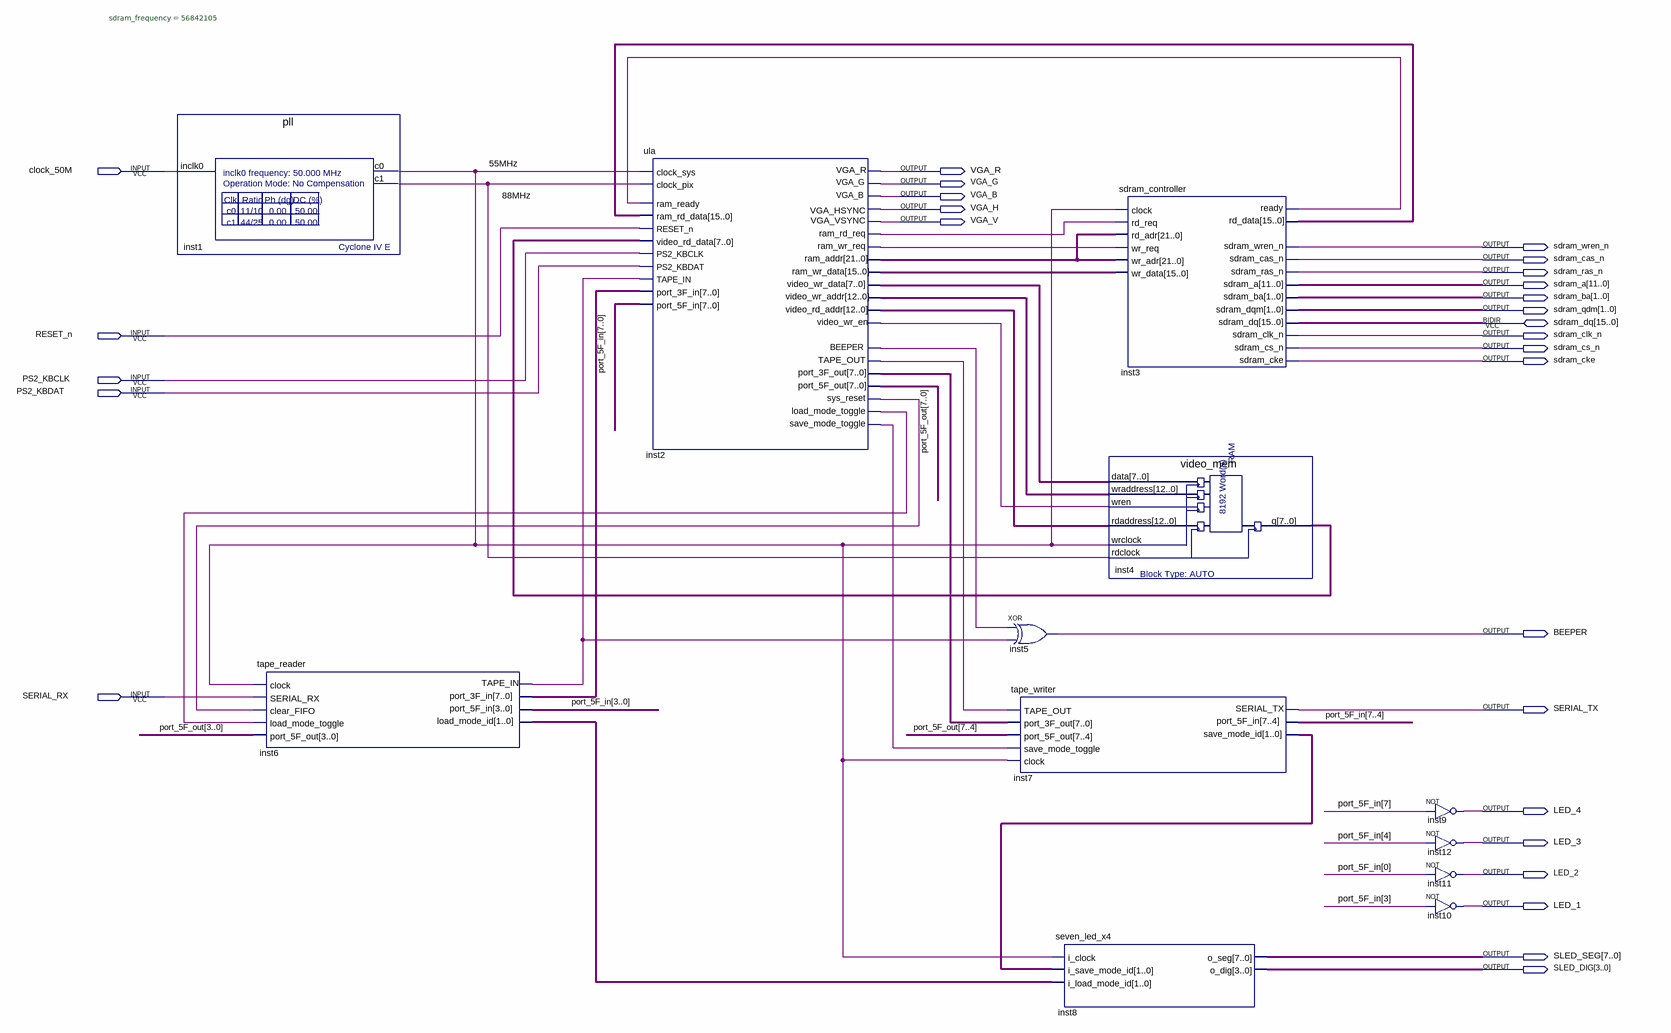
[diagram p0: schematic sheet]
// Quartus schematic zx48.bdf as structural Verilog: 12 symbols, 28 pins
module zx48 (
  input  clock_50M,
  input  RESET_n,
  input  PS2_KBCLK,
  input  PS2_KBDAT,
  input  SERIAL_RX,
  inout  [15:0] sdram_dq,
  output VGA_R,
  output VGA_G,
  output VGA_B,
  output VGA_H,
  output VGA_V,
  output sdram_wren_n,
  output sdram_cas_n,
  output sdram_ras_n,
  output [11:0] sdram_a,
  output [1:0] sdram_ba,
  output [1:0] sdram_qdm,
  output sdram_clk_n,
  output sdram_cs_n,
  output sdram_cke,
  output BEEPER,
  output SERIAL_TX,
  output LED_4,
  output LED_3,
  output LED_2,
  output LED_1,
  output [7:0] SLED_SEG,
  output [3:0] SLED_DIG
);

  wire \55MHz , \88MHz , inst2_beeper, inst2_load_mode_toggle, inst2_ram_rd_req, inst2_ram_wr_req,
       inst2_save_mode_toggle, inst2_sys_reset, inst2_tape_out, inst2_video_wr_en, inst3_ready, inst6_tape_in;
  wire [1:0] inst6_load_mode_id, inst7_save_mode_id;
  wire [7:0] inst2_port_3f_out, inst2_video_wr_data, inst4_q, inst6_port_3f_in, port_5F_in, port_5F_out;
  wire [12:0] inst2_video_rd_addr, inst2_video_wr_addr;
  wire [15:0] inst2_ram_wr_data, inst3_rd_data;
  wire [21:0] inst2_ram_addr;

  pll inst1 (.inclk0(clock_50M), .c0(\55MHz ), .c1(\88MHz ));
  tape_reader inst6 (
    .clock(\55MHz ), .SERIAL_RX(SERIAL_RX), .clear_FIFO(inst2_sys_reset),
    .load_mode_toggle(inst2_load_mode_toggle), .port_5F_out(port_5F_out[3:0]), .TAPE_IN(inst6_tape_in),
    .port_3F_in(inst6_port_3f_in), .port_5F_in(port_5F_in[3:0]), .load_mode_id(inst6_load_mode_id));
  ula inst2 (
    .clock_sys(\55MHz ), .clock_pix(\88MHz ), .ram_ready(inst3_ready), .ram_rd_data(inst3_rd_data),
    .RESET_n(RESET_n), .video_rd_data(inst4_q), .PS2_KBCLK(PS2_KBCLK), .PS2_KBDAT(PS2_KBDAT),
    .TAPE_IN(inst6_tape_in), .port_3F_in(inst6_port_3f_in), .port_5F_in(port_5F_in), .VGA_R(VGA_R),
    .VGA_G(VGA_G), .VGA_B(VGA_B), .VGA_HSYNC(VGA_H), .VGA_VSYNC(VGA_V), .ram_rd_req(inst2_ram_rd_req),
    .ram_wr_req(inst2_ram_wr_req), .ram_addr(inst2_ram_addr), .ram_wr_data(inst2_ram_wr_data),
    .video_wr_data(inst2_video_wr_data), .video_wr_addr(inst2_video_wr_addr),
    .video_rd_addr(inst2_video_rd_addr), .video_wr_en(inst2_video_wr_en), .BEEPER(inst2_beeper),
    .TAPE_OUT(inst2_tape_out), .port_3F_out(inst2_port_3f_out), .port_5F_out(port_5F_out),
    .sys_reset(inst2_sys_reset), .load_mode_toggle(inst2_load_mode_toggle),
    .save_mode_toggle(inst2_save_mode_toggle));
  xor inst5 (BEEPER, inst2_beeper, inst6_tape_in);
  tape_writer inst7 (
    .TAPE_OUT(inst2_tape_out), .port_3F_out(inst2_port_3f_out), .port_5F_out(port_5F_out[7:4]),
    .save_mode_toggle(inst2_save_mode_toggle), .clock(\55MHz ), .SERIAL_TX(SERIAL_TX),
    .port_5F_in(port_5F_in[7:4]), .save_mode_id(inst7_save_mode_id));
  seven_led_x4 inst8 (
    .i_clock(\55MHz ), .i_save_mode_id(inst7_save_mode_id), .i_load_mode_id(inst6_load_mode_id),
    .o_seg(SLED_SEG), .o_dig(SLED_DIG));
  sdram_controller #(.sdram_frequency(56842105)) inst3 (
    .clock(\55MHz ), .rd_req(inst2_ram_rd_req), .rd_adr(inst2_ram_addr), .wr_req(inst2_ram_wr_req),
    .wr_adr(inst2_ram_addr), .wr_data(inst2_ram_wr_data), .ready(inst3_ready), .rd_data(inst3_rd_data),
    .sdram_wren_n(sdram_wren_n), .sdram_cas_n(sdram_cas_n), .sdram_ras_n(sdram_ras_n), .sdram_a(sdram_a),
    .sdram_ba(sdram_ba), .sdram_dqm(sdram_qdm), .sdram_clk_n(sdram_clk_n), .sdram_cs_n(sdram_cs_n),
    .sdram_cke(sdram_cke), .sdram_dq(sdram_dq));
  video_mem inst4 (
    .data(inst2_video_wr_data), .wraddress(inst2_video_wr_addr), .wren(inst2_video_wr_en),
    .rdaddress(inst2_video_rd_addr), .wrclock(\55MHz ), .rdclock(\88MHz ), .q(inst4_q));
  not inst9 (LED_4, port_5F_in[7]);
  not inst12 (LED_3, port_5F_in[4]);
  not inst11 (LED_2, port_5F_in[0]);
  not inst10 (LED_1, port_5F_in[3]);
endmodule
